# EAGLE design DAM1941_analog (EAGLE 9.3.1)

## Sheet 1 of 3
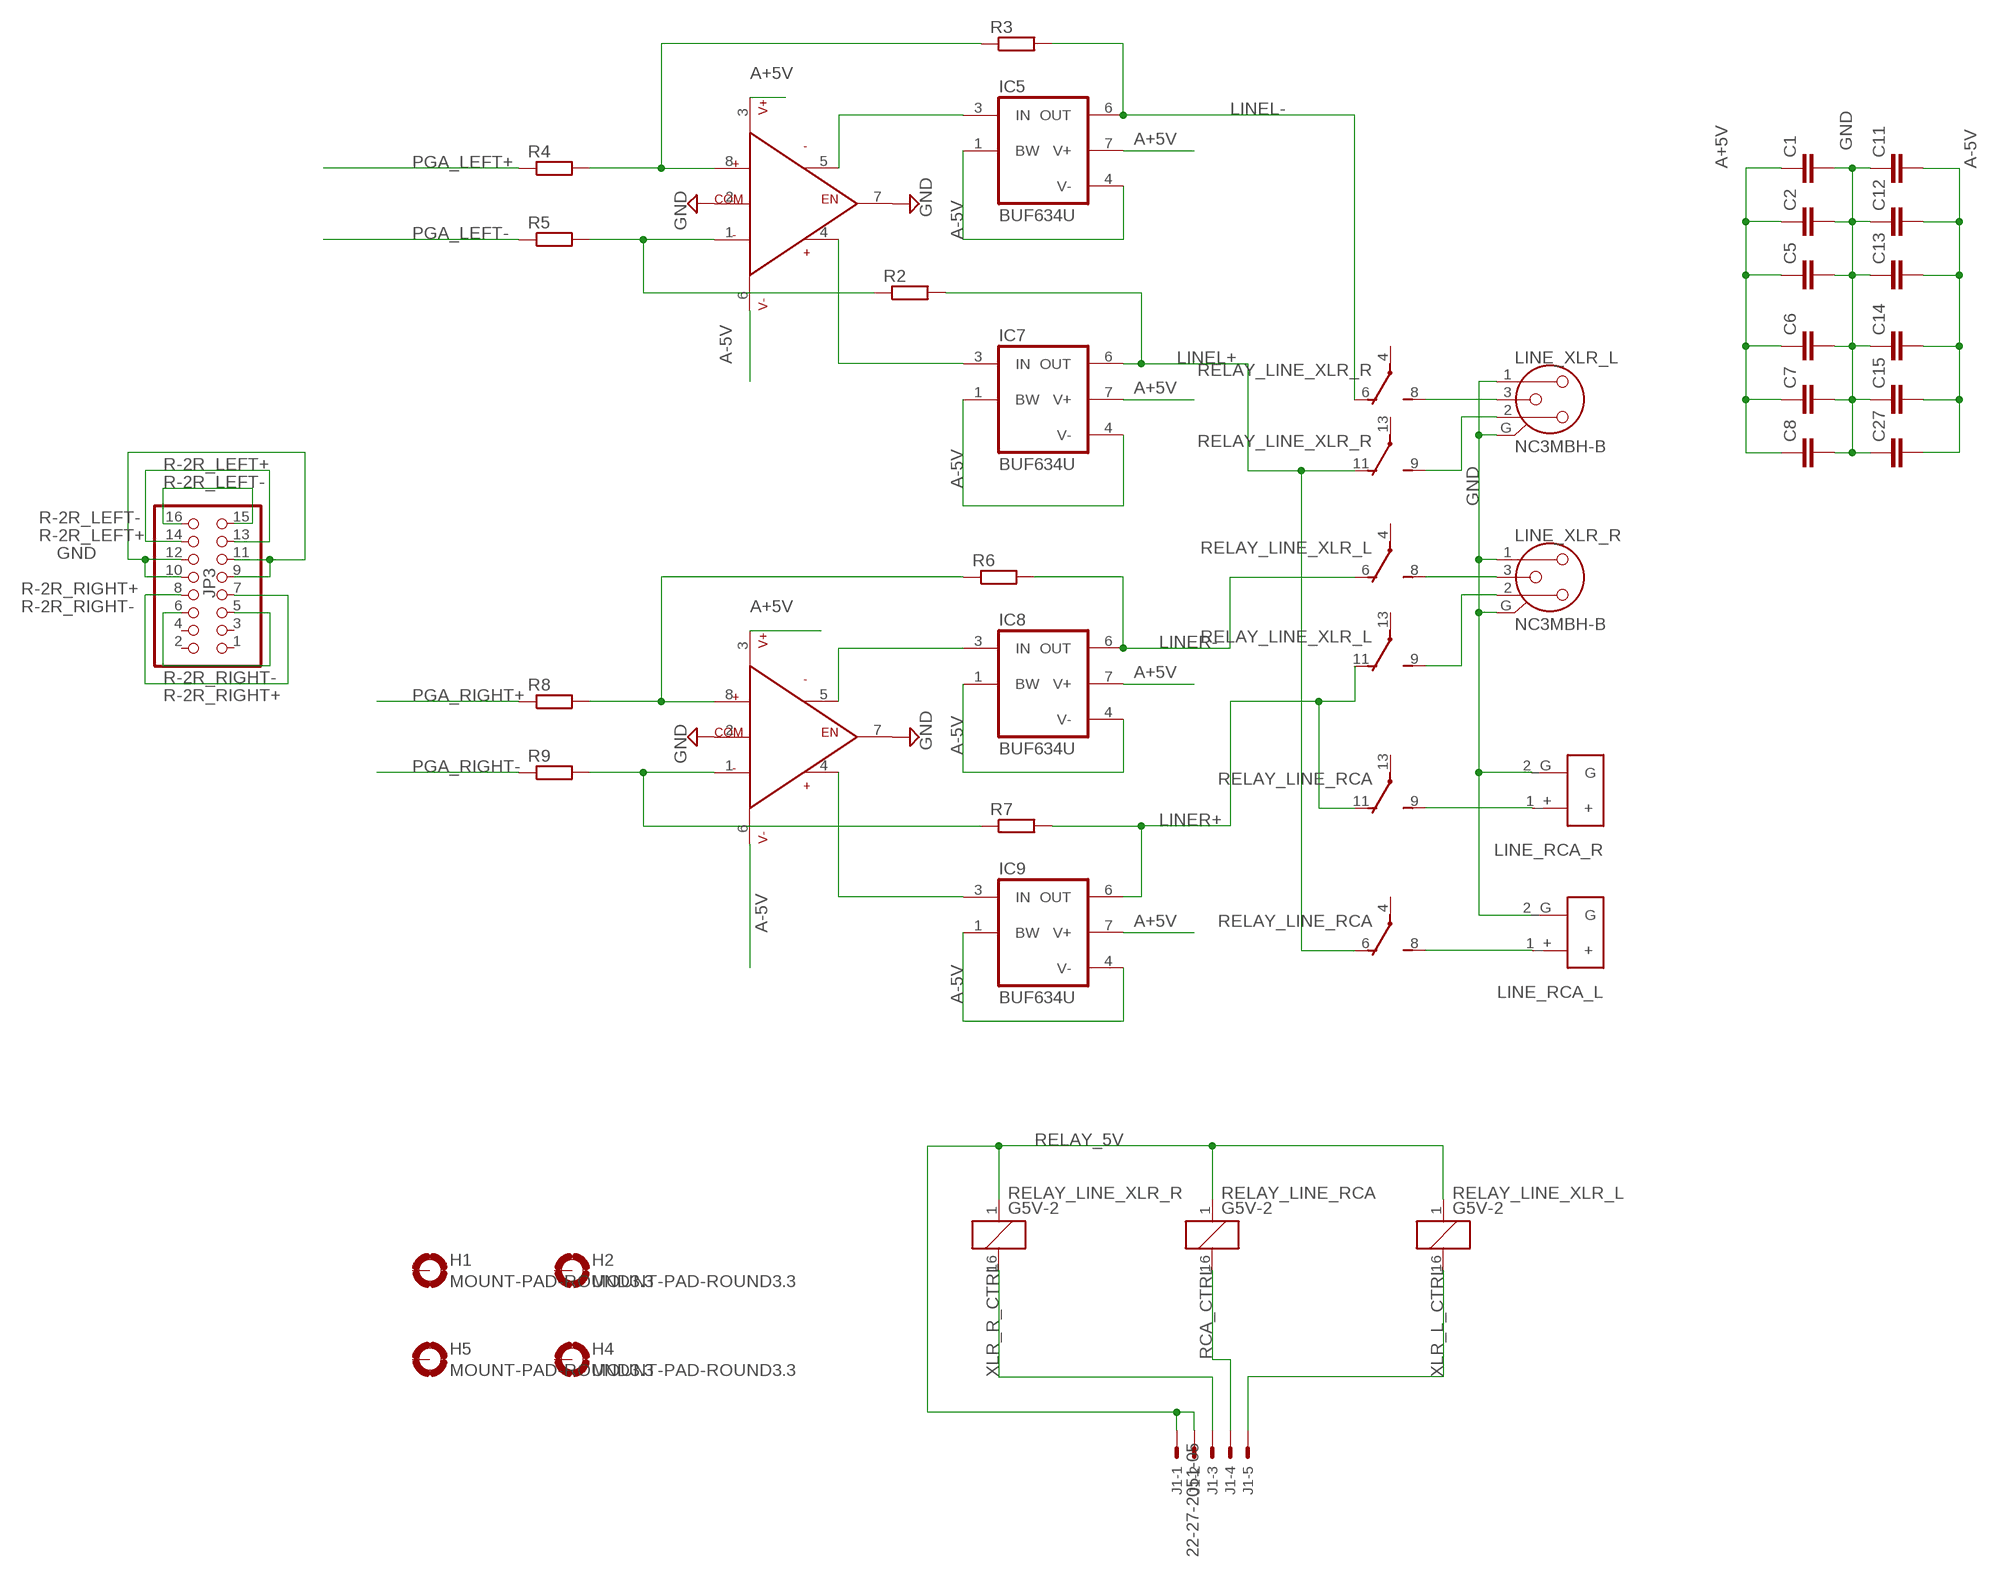
[diagram p0: schematic, sheet 1]

### Parts
C1  C-EU050-050X075  [C050-050X075]
C2  C-EU050-050X075  [C050-050X075]
C5  C-EU050-050X075  [C050-050X075]
C6  C-EU050-050X075  [C050-050X075]
C7  C-EU050-050X075  [C050-050X075]
C8  C-EU050-050X075  [C050-050X075]
C11  C-EU050-050X075  [C050-050X075]
C12  C-EU050-050X075  [C050-050X075]
C13  C-EU050-050X075  [C050-050X075]
C14  C-EU050-050X075  [C050-050X075]
C15  C-EU050-050X075  [C050-050X075]
C27  C-EU050-050X075  [C050-050X075]
H1  MOUNT-PAD-ROUND3.3  [3,3-PAD]
H2  MOUNT-PAD-ROUND3.3  [3,3-PAD]
H4  MOUNT-PAD-ROUND3.3  [3,3-PAD]
H5  MOUNT-PAD-ROUND3.3  [3,3-PAD]
IC5  BUF634U  [SO08]
IC7  BUF634U  [SO08]
IC8  BUF634U  [SO08]
IC9  BUF634U  [SO08]
J1  22-27-2051-05  [6410-05]
JP3  PINHD-2X8  [2X08]
LINE_RCA_L  RCA  [RCA]
LINE_RCA_R  RCA  [RCA]
LINE_XLR_L  NC3MBH-B  [NC3MBH-B]
LINE_XLR_R  NC3MBH-B  [NC3MBH-B]
R2  R-EU_0207/10  [0207/10]
R3  R-EU_0207/10  [0207/10]
R4  R-EU_0207/10  [0207/10]
R5  R-EU_0207/10  [0207/10]
R6  R-EU_0207/10  [0207/10]
R7  R-EU_0207/10  [0207/10]
R8  R-EU_0207/10  [0207/10]
R9  R-EU_0207/10  [0207/10]
RELAY_LINE_RCA  G5V-2  [G5V-2]
RELAY_LINE_XLR_L  G5V-2  [G5V-2]
RELAY_LINE_XLR_R  G5V-2  [G5V-2]
U$1  OPA1632  [SO8]
U$2  OPA1632  [SO8]

### Nets
A+5V: C1.1 C2.1 C5.1 C6.1 C7.1 C8.1 IC5.7(V+) IC7.7(V+) IC8.7(V+) IC9.7(V+) U$1.3(V+) U$2.3(V+) ; also sheet 2,3
A-5V: C11.2 C12.2 C13.2 C14.2 C15.2 C27.2 IC5.1(BW) IC5.4(V-) IC7.1(BW) IC7.4(V-) IC8.1(BW) IC8.4(V-) IC9.1(BW) IC9.4(V-) U$1.6(V-) U$2.6(V-) ; also sheet 2
GND: C1.2 C2.2 C5.2 C6.2 C7.2 C8.2 C11.1 C12.1 C13.1 C14.1 C15.1 C27.1 JP3.9 JP3.10 JP3.11 JP3.12 LINE_RCA_L.2_G(G) LINE_RCA_R.2_G(G) LINE_XLR_L.1 LINE_XLR_L.G LINE_XLR_R.1 LINE_XLR_R.G U$1.2(COM) U$1.7(EN) U$2.2(COM) U$2.7(EN) ; also sheet 2,3
LINEL+: IC7.6(OUT) R2.2 RELAY_LINE_RCA.6(1:O) RELAY_LINE_XLR_R.11(2:O)
LINEL-: IC5.6(OUT) R3.2 RELAY_LINE_XLR_R.6(1:O)
LINER+: IC9.6(OUT) R7.2 RELAY_LINE_RCA.11(2:O) RELAY_LINE_XLR_L.11(2:O)
LINER-: IC8.6(OUT) R6.2 RELAY_LINE_XLR_L.6(1:O)
N$6: LINE_XLR_L.3 RELAY_LINE_XLR_R.8(1:S)
N$8: LINE_XLR_L.2 RELAY_LINE_XLR_R.9(2:S)
N$9: LINE_XLR_R.3 RELAY_LINE_XLR_L.8(1:S)
N$10: LINE_XLR_R.2 RELAY_LINE_XLR_L.9(2:S)
N$11: LINE_RCA_L.1_+(+) RELAY_LINE_RCA.8(1:S)
N$12: LINE_RCA_R.1_+(+) RELAY_LINE_RCA.9(2:S)
N$13: IC5.3(IN) U$1.5(OUT-)
N$14: IC7.3(IN) U$1.4(OUT+)
N$16: R3.1 R4.2 U$1.8(IN+)
N$17: R2.1 R5.2 U$1.1(IN-)
N$20: IC9.3(IN) U$2.4(OUT+)
N$21: IC8.3(IN) U$2.5(OUT-)
N$23: R6.1 R8.2 U$2.8(IN+)
N$24: R7.1 R9.2 U$2.1(IN-)
PGA_LEFT+: R4.1 ; also sheet 2
PGA_LEFT-: R5.1 ; also sheet 2
PGA_RIGHT+: R8.1 ; also sheet 2
PGA_RIGHT-: R9.1 ; also sheet 2
R-2R_LEFT+: JP3.13 JP3.14 ; also sheet 2
R-2R_LEFT-: JP3.15 JP3.16 ; also sheet 2
R-2R_RIGHT+: JP3.7 JP3.8 ; also sheet 2
R-2R_RIGHT-: JP3.5 JP3.6 ; also sheet 2
RCA_CTRL: J1.4 RELAY_LINE_RCA.16
RELAY_5V: J1.1 J1.2 RELAY_LINE_RCA.1 RELAY_LINE_XLR_L.1 RELAY_LINE_XLR_R.1
XLR_L_CTRL: J1.5 RELAY_LINE_XLR_L.16
XLR_R_CTRL: J1.3 RELAY_LINE_XLR_R.16
Unconnected: H1.B3,3(MOUNT) H2.B3,3(MOUNT) H4.B3,3(MOUNT) H5.B3,3(MOUNT) JP3.1 JP3.2 JP3.3 JP3.4 RELAY_LINE_RCA.4(1:P) RELAY_LINE_RCA.13(2:P) RELAY_LINE_XLR_L.4(1:P) RELAY_LINE_XLR_L.13(2:P) RELAY_LINE_XLR_R.4(1:P) RELAY_LINE_XLR_R.13(2:P)

## Sheet 2 of 3
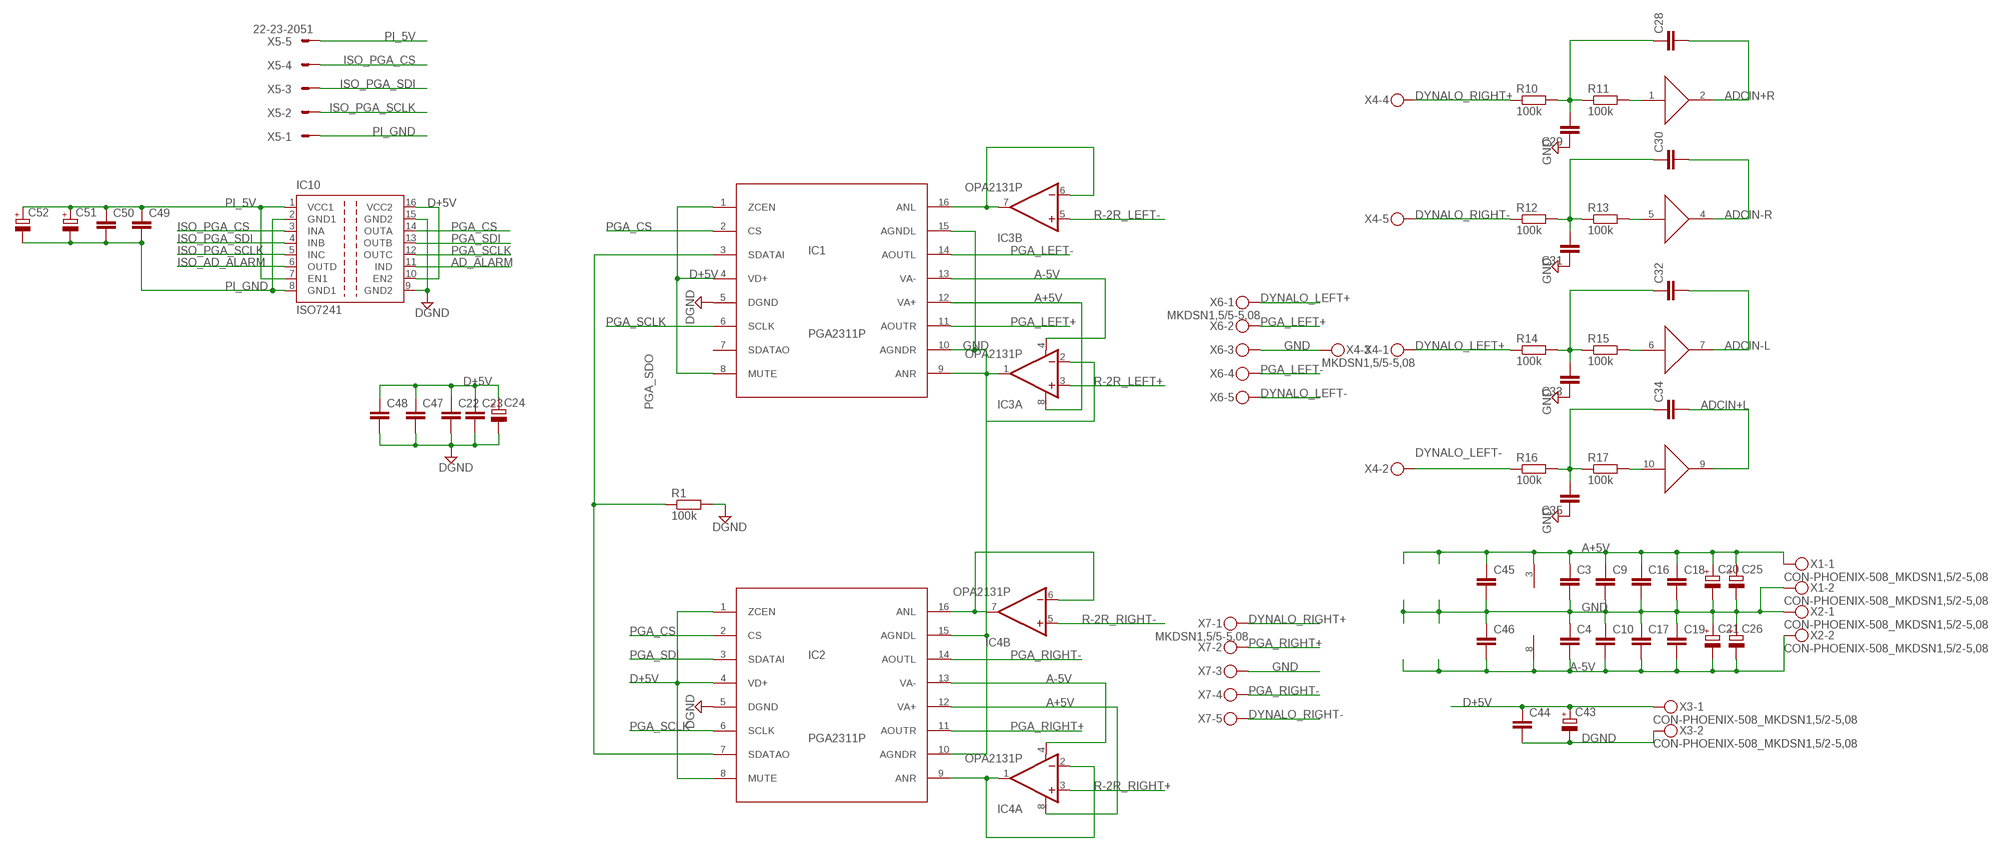
[diagram p1: schematic, sheet 2]

### Parts
C3  C-EU050-050X075  [C050-050X075]
C4  C-EU050-050X075  [C050-050X075]
C9  C-EU050-050X075  [C050-050X075]
C10  C-EU050-050X075  [C050-050X075]
C16  C-EU050-050X075  [C050-050X075]
C17  C-EU050-050X075  [C050-050X075]
C18  C-EU050-050X075  [C050-050X075]
C19  C-EU050-050X075  [C050-050X075]
C20  CPOL-EUE5-10.5  [E5-10,5]
C21  CPOL-EUE5-10.5  [E5-10,5]
C22  C-EU050-050X075  [C050-050X075]
C23  C-EU050-050X075  [C050-050X075]
C24  CPOL-EUE5-10.5  [E5-10,5]
C25  CPOL-EUE5-13  [E5-13]
C26  CPOL-EUE5-13  [E5-13]
C28  C-EUC1206  [C1206]
C29  C-EUC1206  [C1206]
C30  C-EUC1206  [C1206]
C31  C-EUC1206  [C1206]
C32  C-EUC1206  [C1206]
C33  C-EUC1206  [C1206]
C34  C-EUC1206  [C1206]
C35  C-EUC1206  [C1206]
C43  CPOL-EUE5-10.5  [E5-10,5]
C44  C-EU050-050X075  [C050-050X075]
C45  C-EUC0603K  [C0603K]
C46  C-EUC0603K  [C0603K]
C47  C-EUC0603K  [C0603K]
C48  C-EUC0603K  [C0603K]
C49  C-EUC0603K  [C0603K]
C50  C-EUC0603K  [C0603K]
C51  CPOL-EUE5-8.5  [E5-8,5]
C52  CPOL-EUE5-8.5  [E5-8,5]
IC1  PGA2311P  [DIL16]
IC2  PGA2311P  [DIL16]
IC3  OPA2131P  [DIL08]
IC4  OPA2131P  [DIL08]
IC10  ISO7241  [SO-16DW]
R1  100k  R-EU_MELF0204R  [MINI_MELF-0204R]
R10  100k  R-EU_MELF0204R  [MINI_MELF-0204R]
R11  100k  R-EU_MELF0204R  [MINI_MELF-0204R]
R12  100k  R-EU_MELF0204R  [MINI_MELF-0204R]
R13  100k  R-EU_MELF0204R  [MINI_MELF-0204R]
R14  100k  R-EU_MELF0204R  [MINI_MELF-0204R]
R15  100k  R-EU_MELF0204R  [MINI_MELF-0204R]
R16  100k  R-EU_MELF0204R  [MINI_MELF-0204R]
R17  100k  R-EU_MELF0204R  [MINI_MELF-0204R]
U$3  AD8244  [MSOP10]
X1  CON-PHOENIX-508_MKDSN1,5/2-5,08  [CON-PHOENIX-508_MKDSN1,5/2-5,08]
X2  CON-PHOENIX-508_MKDSN1,5/2-5,08  [CON-PHOENIX-508_MKDSN1,5/2-5,08]
X3  CON-PHOENIX-508_MKDSN1,5/2-5,08  [CON-PHOENIX-508_MKDSN1,5/2-5,08]
X4  MKDSN1,5/5-5,08  [MKDSN1,5/5-5,08]
X5  22-23-2051  [22-23-2051]
X6  MKDSN1,5/5-5,08  [MKDSN1,5/5-5,08]
X7  MKDSN1,5/5-5,08  [MKDSN1,5/5-5,08]

### Nets
A+5V: C3.1 C9.1 C16.1 C18.1 C20.+ C25.+ C45.1 IC1.12(VA+) IC2.12(VA+) IC3.8(A:V+) IC4.8(A:V+) U$3.3(V+) X1.1 ; also sheet 1,3
A-5V: C4.2 C10.2 C17.2 C19.2 C21.- C26.- C46.2 IC1.13(VA-) IC2.13(VA-) IC3.4(A:V-) IC4.4(A:V-) U$3.8(V-) X2.2 ; also sheet 1
AD_ALARM: IC10.11(IND) ; also sheet 3
ADCIN+L: C34.2 U$3.9(OUT) ; also sheet 3
ADCIN+R: C28.2 U$3.2(OUT) ; also sheet 3
ADCIN-L: C32.2 U$3.7(OUT) ; also sheet 3
ADCIN-R: C30.2 U$3.4(OUT) ; also sheet 3
D+5V: C22.1 C23.1 C24.+ C43.+ C44.1 C47.1 C48.1 IC1.1(ZCEN) IC1.4(VD+) IC1.8(MUTE) IC2.1(ZCEN) IC2.4(VD+) IC2.8(MUTE) IC10.10(EN2) IC10.16(VCC2) X3.1 ; also sheet 3
DGND: C22.2 C23.2 C24.- C43.- C44.2 C47.2 C48.2 IC1.5(DGND) IC2.5(DGND) IC10.9(GND2) IC10.15(GND2) R1.2 X3.2 ; also sheet 3
DYNALO_LEFT+: R14.1 X4.1 X6.1
DYNALO_LEFT-: R16.1 X4.2 X6.5
DYNALO_RIGHT+: R10.1 X4.4 X7.1
DYNALO_RIGHT-: R12.1 X4.5 X7.5
GND: C3.2 C4.1 C9.2 C10.1 C16.2 C17.1 C18.2 C19.1 C20.- C21.+ C25.- C26.+ C29.1 C31.1 C33.1 C35.1 C45.2 C46.1 IC1.10(AGNDR) IC1.15(AGNDL) IC2.10(AGNDR) IC2.15(AGNDL) X1.2 X2.1 X4.3 X6.3 X7.3 ; also sheet 1,3
ISO_AD_ALARM: IC10.6(OUTD) ; also sheet 3
ISO_PGA_CS: IC10.3(INA) X5.4
ISO_PGA_SCLK: IC10.5(INC) X5.2
ISO_PGA_SDI: IC10.4(INB) X5.3
N$2: IC2.9(ANR) IC4.1(A:OUT) IC4.2(A:-IN)
N$3: IC2.16(ANL) IC4.6(B:-IN) IC4.7(B:OUT)
N$4: IC1.9(ANR) IC3.1(A:OUT) IC3.2(A:-IN)
N$5: IC1.16(ANL) IC3.6(B:-IN) IC3.7(B:OUT)
N$25: C28.1 C29.2 R10.2 R11.1
N$26: R11.2 U$3.1(IN)
N$27: C30.1 C31.2 R12.2 R13.1
N$29: R13.2 U$3.5(IN)
N$31: C32.1 C33.2 R14.2 R15.1
N$32: R15.2 U$3.6(IN)
N$34: C34.1 C35.2 R16.2 R17.1
N$35: R17.2 U$3.10(IN)
PGA_CS: IC1.2(CS) IC2.2(CS) IC10.14(OUTA)
PGA_LEFT+: IC1.11(AOUTR) X6.2 ; also sheet 1
PGA_LEFT-: IC1.14(AOUTL) X6.4 ; also sheet 1
PGA_RIGHT+: IC2.11(AOUTR) X7.2 ; also sheet 1
PGA_RIGHT-: IC2.14(AOUTL) X7.4 ; also sheet 1
PGA_SCLK: IC1.6(SCLK) IC2.6(SCLK) IC10.12(OUTC)
PGA_SDI: IC2.3(SDATAI) IC10.13(OUTB)
PGA_SDO: IC1.3(SDATAI) IC2.7(SDATAO) R1.1
PI_5V: C49.1 C50.1 C51.+ C52.+ IC10.1(VCC1) IC10.7(EN1) X5.5 ; also sheet 3
PI_GND: C49.2 C50.2 C51.- C52.- IC10.2(GND1) IC10.8(GND1) X5.1 ; also sheet 3
R-2R_LEFT+: IC3.3(A:+IN) ; also sheet 1
R-2R_LEFT-: IC3.5(B:+IN) ; also sheet 1
R-2R_RIGHT+: IC4.3(A:+IN) ; also sheet 1
R-2R_RIGHT-: IC4.5(B:+IN) ; also sheet 1
Unconnected: IC1.7(SDATAO)

## Sheet 3 of 3
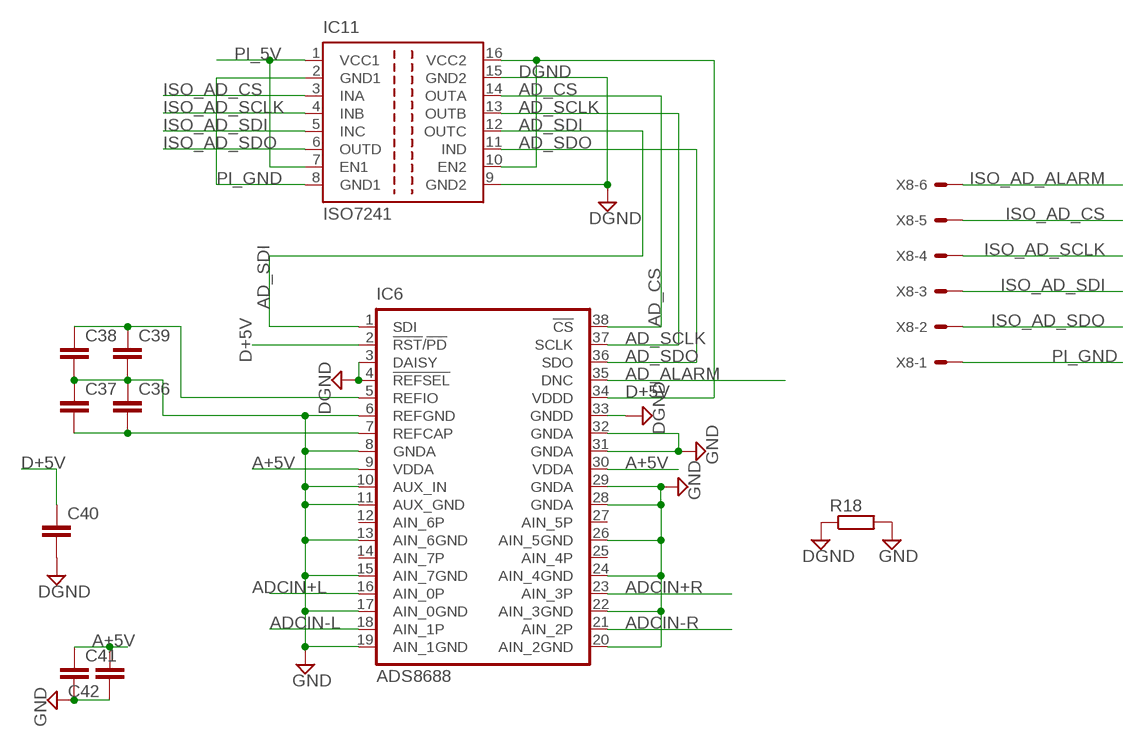
[diagram p2: schematic, sheet 3]

### Parts
C36  C-EUC0603K  [C0603K]
C37  C-EU050-035X075  [C050-035X075]
C38  C-EU050-035X075  [C050-035X075]
C39  C-EUC0603K  [C0603K]
C40  C-EUC0603K  [C0603K]
C41  C-EUC0603K  [C0603K]
C42  C-EUC0603K  [C0603K]
IC6  ADS8688  [DBT_R-PDSO-G38]
IC11  ISO7241  [SO-16DW]
R18  R-EU_MELF0204R  [MINI_MELF-0204R]
X8  22-23-2061  [22-23-2061]

### Nets
A+5V: C41.1 C42.2 IC6.9(VDDA) IC6.30(VDDA) ; also sheet 1,2
AD_ALARM: IC6.35(DNC) ; also sheet 2
AD_CS: IC6.38(!CS) IC11.14(OUTA)
AD_SCLK: IC6.37(SCLK) IC11.13(OUTB)
AD_SDI: IC6.1(SDI) IC11.12(OUTC)
AD_SDO: IC6.36(SDO) IC11.11(IND)
ADCIN+L: IC6.16(AIN_0P) ; also sheet 2
ADCIN+R: IC6.23(AIN_3P) ; also sheet 2
ADCIN-L: IC6.18(AIN_1P) ; also sheet 2
ADCIN-R: IC6.21(AIN_2P) ; also sheet 2
D+5V: C40.1 IC6.2(!RST!/!PD) IC6.34(VDDD) IC11.10(EN2) IC11.16(VCC2) ; also sheet 2
DGND: C40.2 IC6.3(DAISY) IC6.4(!REFSEL) IC6.33(GNDD) IC11.9(GND2) IC11.15(GND2) R18.1 ; also sheet 2
GND: C36.1 C37.1 C38.2 C39.2 C41.2 C42.1 IC6.6(REFGND) IC6.8(GNDA) IC6.10(AUX_IN) IC6.11(AUX_GND) IC6.13(AIN_6GND) IC6.15(AIN_7GND) IC6.17(AIN_0GND) IC6.19(AIN_1GND) IC6.20(AIN_2GND) IC6.22(AIN_3GND) IC6.24(AIN_4GND) IC6.26(AIN_5GND) IC6.28(GNDA) IC6.29(GNDA) IC6.31(GNDA) IC6.32(GNDA) R18.2 ; also sheet 1,2
ISO_AD_ALARM: X8.6 ; also sheet 2
ISO_AD_CS: IC11.3(INA) X8.5
ISO_AD_SCLK: IC11.4(INB) X8.4
ISO_AD_SDI: IC11.5(INC) X8.3
ISO_AD_SDO: IC11.6(OUTD) X8.2
N$30: C36.2 C37.2 IC6.7(REFCAP)
N$33: C38.1 C39.1 IC6.5(REFIO)
PI_5V: IC11.1(VCC1) IC11.7(EN1) ; also sheet 2
PI_GND: IC11.2(GND1) IC11.8(GND1) X8.1 ; also sheet 2
Unconnected: IC6.12(AIN_6P) IC6.14(AIN_7P) IC6.25(AIN_4P) IC6.27(AIN_5P)

## Library data of the parts
C1-C19 C22 C23 C27-C42 C44-C50 = Vwvwbg:C-EU: CAPACITOR, European symbol
C20 C21 C24-C26 C43 C51 C52 = Vwvwbg:CPOL-EU: POLARIZED CAPACITOR, European symbol
H1 H2 H4 H5 = holes:MOUNT-PAD-ROUND: MOUNTING PAD, round
IC1 IC2 = Vwvwbg:PGA2311
IC3 IC4 = burr-brown:OPA2131: General Purpose FET-Input Operational Amplifiers Product Folder:OPA2131; OC_FARNELL: unknown; OC_NEWARK: unknown
IC5 IC7-IC9 = burr-brown:BUF634: 250mA High-Speed Buffer; MF: TEXAS INSTRUMENTS; MPN: BUF634U; OC_FARNELL: 4733617; OC_NEWARK: 27C6567
IC6 = texas:ADS8688: ADS868x 16-Bit, 500-kSPS, 8-Channel, Single-Supply, SAR ADCs with Bipolar Input Ranges Source: Data sheet <http://www.ti.com/lit/ds/symlink/ads8688.pdf>
IC10 IC11 = texas:ISO7241: HIGH SPEED QUAD DIGITAL ISOLATORS Source: http://focus.ti.com/lit/ds/symlink/iso7240m.pdf; MPN: ISO7241CDW; OC_FARNELL: 1575372; OC_NEWARK: 73M3155
J1 = con-molex:22-?-05: CONNECTOR wire to board 2.54 mm (.1 inch) pitch header; MF: MOLEX; OC_FARNELL: unknown; OC_NEWARK: unknown
JP3 = pinhead:PINHD-2X8: PIN HEADER
LINE_RCA_L LINE_RCA_R = Vwvwbg:RCA
LINE_XLR_L LINE_XLR_R = con-neutrik_ag:NC3: Neutrik Audio Connector XLR SERIES Stereo 1/4" jack Source: www.neutrik.com/; MPN: NC3MBH-B; OC_FARNELL: unknown; OC_NEWARK: 27B4288
R1-R18 = Vwvwbg:R-EU_: RESISTOR, European symbol
RELAY_LINE_RCA RELAY_LINE_XLR_L RELAY_LINE_XLR_R = relay:G5V-2: OMRON PCB Relay Source: http://www.omron.com/ecb/products/pdf/en-g5v2.pdf; MPN: G5V-2 5DC; OC_FARNELL: 9949488; OC_NEWARK: 78K5703
U$1 U$2 = Vwvwbg:OPA1632
U$3 = Vwvwbg:AD8244
X1-X3 = Vwvwbg:CON-PHOENIX-508_MKDSN1,5/2-5,08: MKDSN 1,5/ 2-5,08 Printklemme Nennstrom: 13,5 A Nennspannung: 250 V Rastermaß: 5,08 mm Polzahl: 2 Anschlussart: Schraubanschluss Montage: Löten Anschlussrichtung Leiter/Platine: 0 ° Artikelnummer: 1729128 Source: http://eshop.phoenixcontact.com .. 1729128.pdf
X4 X6 X7 = Vwvwbg:MKDSN1,5/5-5,08: MKDSN 1,5/ 5-5,08 Printklemme Nennstrom: 13,5 A Nennspannung: 250 V Rastermaß: 5,08 mm Polzahl: 5 Anschlussart: Schraubanschluss Montage: Löten Anschlussrichtung Leiter/Platine: 0 ° Artikelnummer: 1729157 Source: http://eshop.phoenixcontact.com .. 1729157.pdf
X5 = con-molex:22-23-2051: .100" (2.54mm) Center Header - 5 Pin; MF: MOLEX; MPN: 22-23-2051; OC_FARNELL: 1462952; OC_NEWARK: 38C9178
X8 = con-molex:22-23-2061: .100" (2.54mm) Center Header - 6 Pin; MF: MOLEX; MPN: 22-23-2061; OC_FARNELL: 1462922; OC_NEWARK: 27C1933

## Board
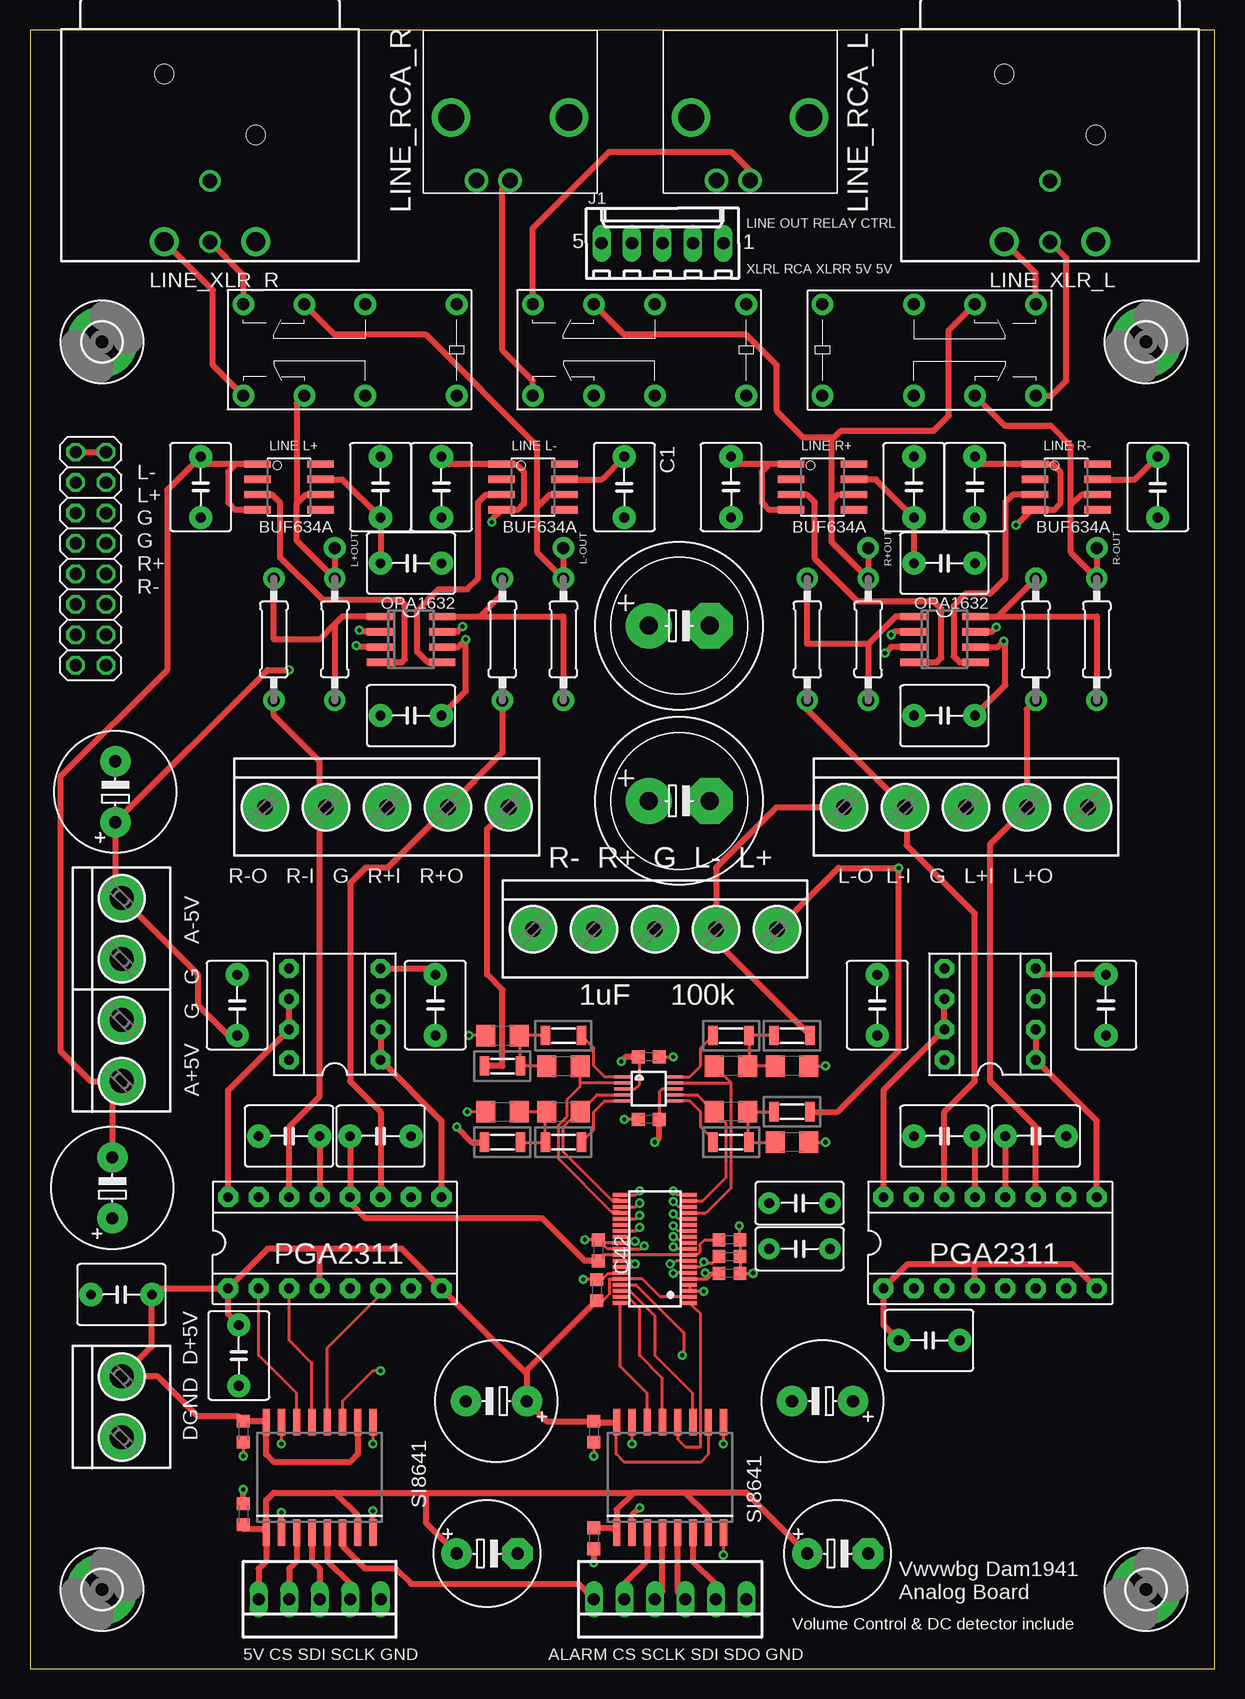
[diagram p3: board, top side]
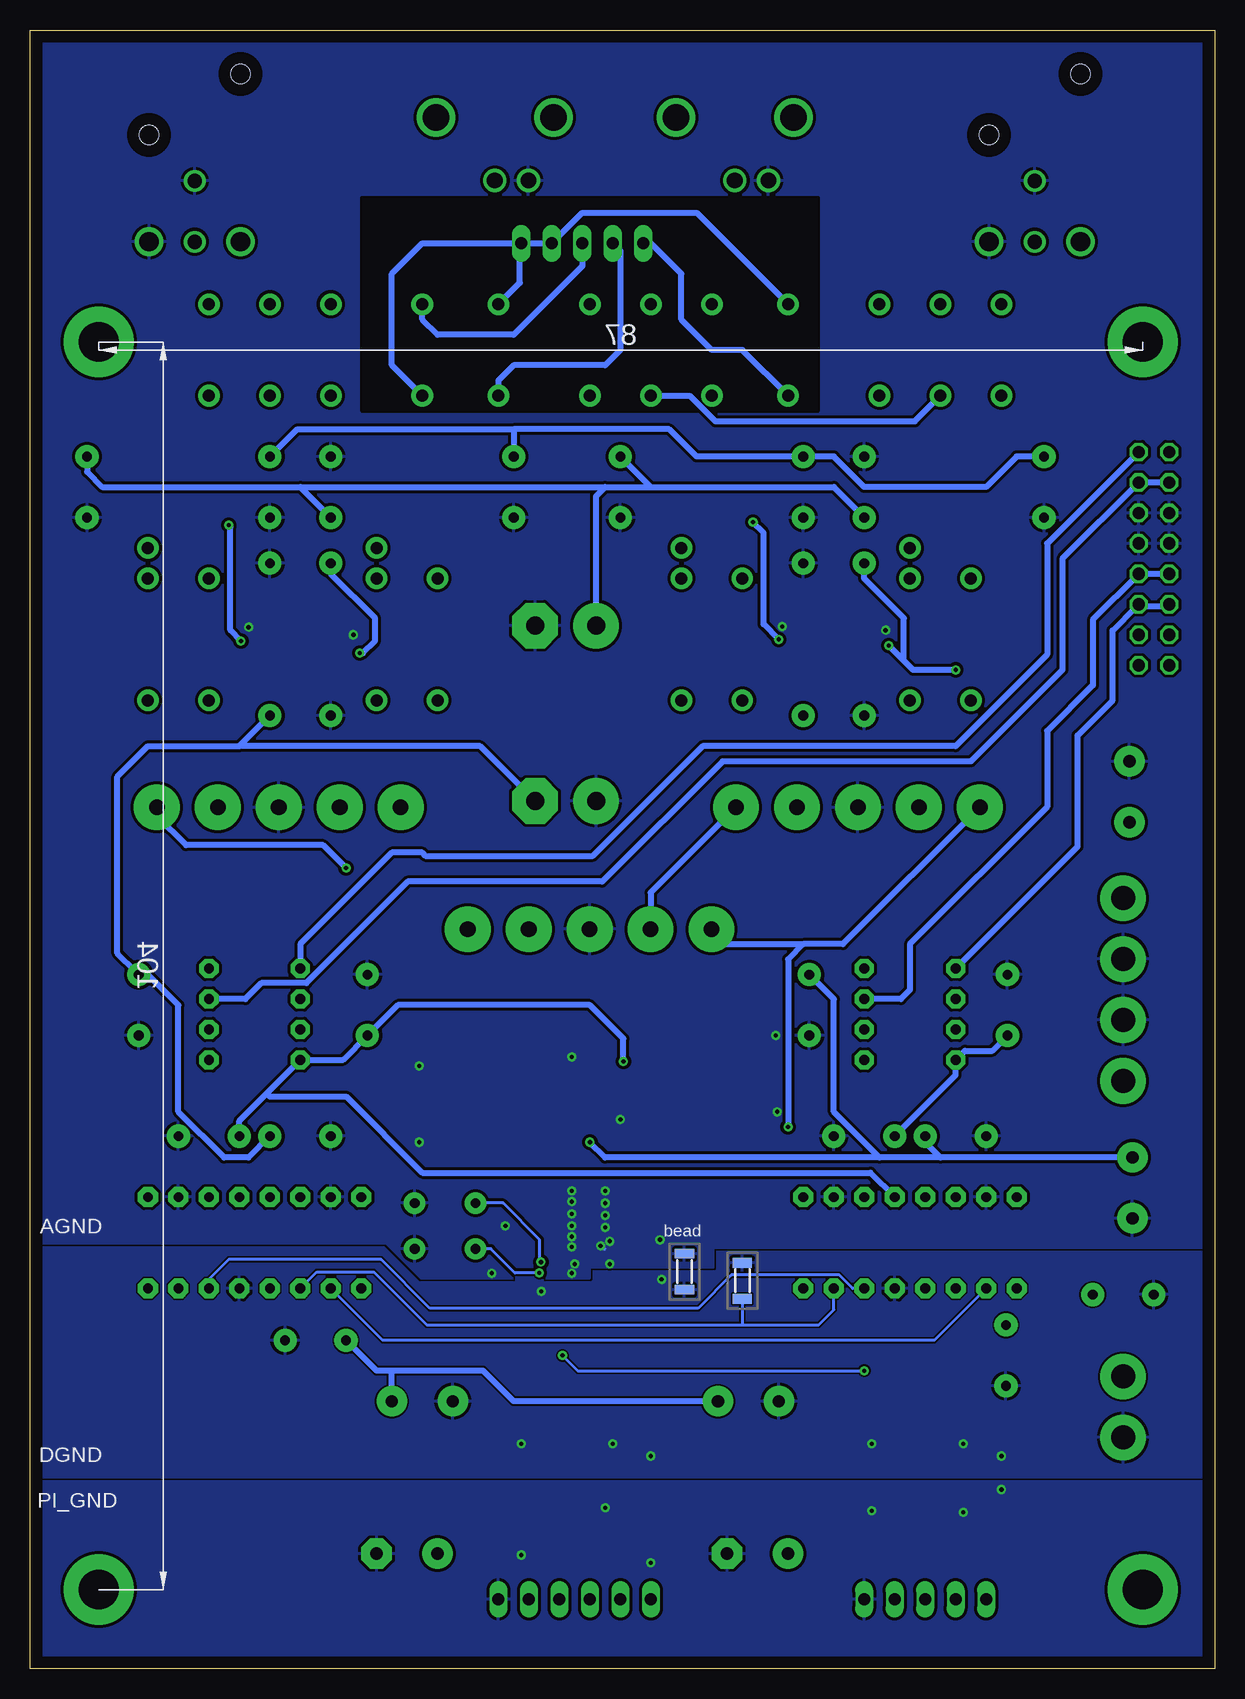
[diagram p4: board, bottom side, seen from below]

Size 98.73 x 136.6 mm. Coordinates in mm from the lower left corner, seen from the top.
Outline: 0,0 98.73,0 98.73,136.6 0,136.6 0,0
Copper layers (1*16): Top 0.035mm / dielectric 1.5mm / Bottom 0.035mm
Design rules "default *": minimum track width 6mil, minimum drill 0.35mm, track to track 6mil, track to pad 6mil, pad to pad 6mil, via to via 6mil, smd to smd 6mil, copper to edge 40mil, drill to drill 6mil, minimum pad ring 10mil, minimum via ring 8mil, stop-mask expansion 4mil, vias tented up to drill 0.36mm, thermal gap 10mil

### Footprints (pad centres in the part's own frame; a part is rotated, then mirrored left to right if it is on the bottom)
C050-050X075 = drill 0.813 pad 1.93: 1 -2.54,0; 2 2.54,0
E5-10,5 = drill 1.016 pad 2.54: + -2.54,0; - 2.54,0
E5-13 = drill 1.5 pad 3.81: + -2.54,0 | drill 1.5 pad 3.81 octagon: - 2.54,0
C1206 = smd 1.6 x 1.8: 1 -1.4,0; 2 1.4,0
C0603K = smd 1.05 x 1.08: 1 -0.875,0; 2 0.875,0
C050-035X075 = drill 0.813 pad 1.778: 1 -2.54,0; 2 2.54,0
E5-8,5 = drill 1.016 pad 2.54: + -2.54,0 | drill 1.016 pad 2.54 octagon: - 2.54,0
3,3-PAD = drill 3.3 pad 5.842: B3,3 0,0
DIL16 = drill 0.813 pad 1.676 octagon: 1 -8.89,-3.81; 2 -6.35,-3.81; 3 -3.81,-3.81; 4 -1.27,-3.81; 5 1.27,-3.81; 6 3.81,-3.81; 7 6.35,-3.81; 8 8.89,-3.81; 9 8.89,3.81; 10 6.35,3.81; 11 3.81,3.81; 12 1.27,3.81; 13 -1.27,3.81; 14 -3.81,3.81; 15 -6.35,3.81; 16 -8.89,3.81
DIL08 = drill 0.813 pad 1.6 octagon: 1 -3.81,-3.81; 2 -1.27,-3.81; 3 1.27,-3.81; 4 3.81,-3.81; 5 3.81,3.81; 6 1.27,3.81; 7 -1.27,3.81; 8 -3.81,3.81
SO08 = smd 0.61 x 2.21: 1 -1.905,-2.616; 2 -0.635,-2.616; 3 0.635,-2.616; 4 1.905,-2.616; 5 1.905,2.616; 6 0.635,2.616; 7 -0.635,2.616; 8 -1.905,2.616
DBT_R-PDSO-G38 = smd 0.3 x 1.2: 1 -4.5,-2.9; 2 -4,-2.9; 3 -3.5,-2.9; 4 -3,-2.9; 5 -2.5,-2.9; 6 -2,-2.9; 7 -1.5,-2.9; 8 -1,-2.9; 9 -0.5,-2.9; 10 0,-2.9; 11 0.5,-2.9; 12 1,-2.9; 13 1.5,-2.9; 14 2,-2.9; 15 2.5,-2.9; 16 3,-2.9; 17 3.5,-2.9; 18 4,-2.9; 19 4.5,-2.9; 20 4.5,2.9; 21 4,2.9; 22 3.5,2.9; 23 3,2.9; 24 2.5,2.9; 25 2,2.9; 26 1.5,2.9; 27 1,2.9; 28 0.5,2.9; 29 0,2.9; 30 -0.5,2.9; 31 -1,2.9; 32 -1.5,2.9; 33 -2,2.9; 34 -2.5,2.9; 35 -3,2.9; 36 -3.5,2.9; 37 -4,2.9; 38 -4.5,2.9
SO-16DW = smd 0.6 x 2.2: 1 -4.445,-4.6; 2 -3.175,-4.6; 3 -1.905,-4.6; 4 -0.635,-4.6; 5 0.635,-4.6; 6 1.905,-4.6; 7 3.175,-4.6; 8 4.445,-4.6; 9 4.445,4.6; 10 3.175,4.6; 11 1.905,4.6; 12 0.635,4.6; 13 -0.635,4.6; 14 -1.905,4.6; 15 -3.175,4.6; 16 -4.445,4.6
6410-05 = drill 1.016 long: 1 5.08,0; 2 2.54,0; 3 0,0; 4 -2.54,0; 5 -5.08,0
2X08 = drill 1.016 octagon: 1 -8.89,-1.27; 2 -8.89,1.27; 3 -6.35,-1.27; 4 -6.35,1.27; 5 -3.81,-1.27; 6 -3.81,1.27; 7 -1.27,-1.27; 8 -1.27,1.27; 9 1.27,-1.27; 10 1.27,1.27; 11 3.81,-1.27; 12 3.81,1.27; 13 6.35,-1.27; 14 6.35,1.27; 15 8.89,-1.27; 16 8.89,1.27
RCA = drill 1.3: 1_+ 0,0; 2_G -2.8,0 | drill 2.2: 3_NC -4.9,5.25; 4_NC 4.9,5.25
NC3MBH-B = drill 1.6: 1 3.81,0; 2 -3.81,0 | drill 1.2: 3 0,0; G 0,5.08 | hole 1.6: -3.81,13.97; 3.81,8.89
MINI_MELF-0204R = smd 0.8 x 1.6: 1 -1.5,0; 2 1.5,0
0207/10 = drill 1 pad 1.778: 1 -5.08,0; 2 5.08,0
G5V-2 = drill 1 pad 1.8: 1 -8.89,-3.81; 4 -1.27,-3.81; 6 3.81,-3.81; 8 8.89,-3.81; 9 8.89,3.81; 11 3.81,3.81; 13 -1.27,3.81; 16 -8.89,3.81
SO8 = smd 0.6 x 2.2: 1 -1.905,-2.6; 2 -0.635,-2.6; 3 0.635,-2.6; 4 1.905,-2.6; 5 1.905,2.6; 6 0.635,2.6; 7 -0.635,2.6; 8 -1.905,2.6
MSOP10 = smd 0.25 x 1.5: 1 -1,-2.113; 2 -0.5,-2.113; 3 0,-2.113; 4 0.5,-2.113; 5 1,-2.113; 6 1,2.113; 7 0.5,2.113; 8 0,2.113; 9 -0.5,2.113; 10 -1,2.113
CON-PHOENIX-508_MKDSN1,5/2-5,08 = drill 2 pad 3.81: 1 -2.561,0.025; 2 2.519,0.025
MKDSN1,5/5-5,08 = drill 1.3 pad 3.81: 1 -10.181,0.025; 2 -5.101,0.025; 3 -0.021,0.025; 4 5.059,0.025; 5 10.139,0.025
22-23-2051 = drill 1 long: 1 -5.08,0; 2 -2.54,0; 3 0,0; 4 2.54,0; 5 5.08,0
22-23-2061 = drill 1 long: 1 -6.35,0; 2 -3.81,0; 3 -1.27,0; 4 1.27,0; 5 3.81,0; 6 6.35,0

### Placement (x,y rotation side)
C1  49.53,98.5 270 top
C2  29.21,98.5 90 top
C3  83.82,44.4 0 top
C4  76.2,44.4 0 top
C5  73.66,98.5 90 top
C6  93.98,98.5 270 top
C7  76.2,92.15 0 top
C8  31.75,92.15 0 top
C9  29.21,44.4 0 top
C10  21.59,44.4 0 top
C11  34.29,98.5 90 top
C12  58.42,98.5 90 top
C13  78.74,98.5 90 top
C14  14.22,98.5 90 top
C15  31.75,79.45 0 top
C16  70.61,55.32 90 top
C17  89.66,55.32 90 top
C18  17.27,55.32 90 top
C19  33.78,55.32 90 top
C20  7.11,73.1 90 top
C21  6.86,40.08 90 top
C22  74.93,27.38 0 top
C23  17.4,26.11 270 top
C24  38.86,22.3 180 top
C25  54.1,86.94 0 top
C26  54.1,72.34 0 top
C27  76.2,79.45 0 top
C28  44.45,50.24 0 top
C29  39.37,52.78 0 top
C30  44.45,46.43 0 top
C31  39.37,46.43 0 top
C32  58.42,46.43 180 top
C33  63.5,43.89 180 top
C34  58.42,50.24 180 top
C35  63.5,50.24 180 top
C36  58.29,34.36 180 top
C37  64.14,38.81 180 top
C38  64.14,35 0 top
C39  58.29,32.97 0 top
C40  47.24,31.57 90 top
C41  58.29,35.76 0 top
C42  47.37,34.87 270 top
C43  66.04,22.3 180 top
C44  7.62,31.19 180 top
C45  51.56,51 0 top
C46  51.56,45.79 0 top
C47  17.78,19.76 270 top
C48  46.99,19.76 270 top
C49  46.99,10.87 270 top
C50  17.78,12.9 90 top
C51  67.31,9.6 0 top
C52  38.1,9.6 0 top
H1  6,6.6 0 top
H2  93,6.6 0 top
H4  6,110.6 0 top
H5  93,110.6 0 top
IC1  80.01,35.51 0 top
IC2  25.4,35.51 0 top
IC3  80.01,54.56 90 top
IC4  25.4,54.56 90 top
IC5  86.36,98.5 270 top
IC6  52.07,35 90 top
IC7  66.04,98.5 270 top
IC8  41.91,98.5 270 top
IC9  21.59,98.5 270 top
IC10  24.13,15.95 0 top
IC11  53.34,15.95 0 top
J1  52.7,118.82 0 top
JP3  5.07,92.53 90 top
LINE_RCA_L  60,124.05 0 top
LINE_RCA_R  40,124.05 0 top
LINE_XLR_L  85,118.95 0 top
LINE_XLR_R  15,118.95 0 top
R1  39.37,32.33 90 bottom
R2  69.85,85.8 90 top
R3  88.9,85.8 90 top
R4  83.82,85.8 90 top
R5  64.77,85.8 90 top
R6  44.45,85.8 90 top
R7  25.4,85.8 90 top
R8  39.37,85.8 90 top
R9  20.32,85.8 90 top
R10  39.37,50.24 0 top
R11  44.45,52.78 0 top
R12  39.37,43.89 0 top
R13  44.45,43.89 0 top
R14  63.5,46.43 180 top
R15  58.42,43.89 180 top
R16  63.5,52.78 180 top
R17  58.42,52.78 180 top
R18  44.2,33.09 90 bottom
RELAY_LINE_RCA  50.8,109.93 180 top
RELAY_LINE_XLR_L  26.67,109.93 180 top
RELAY_LINE_XLR_R  74.93,109.93 0 top
U$1  76.2,85.8 270 top
U$2  31.75,85.8 270 top
U$3  51.56,48.33 270 top
X1  7.62,61.67 270 top
X2  7.62,51.51 270 top
X3  7.62,21.79 270 top
X4  52.07,61.67 180 top
X5  24.13,5.79 180 top
X6  77.98,71.83 180 top
X7  29.72,71.83 180 top
X8  53.34,5.79 180 top

### Tracks (layer width: path | path; a pad name or v marks a point on that pad's centre or on a via)
A+5V  (via drill 0.35)
  Top 0.254: C42.2 47.87,34.5 IC6.30 IC6.9 55.04,34.57 55.69,34.57 55.85,34.73 55.85,35.38 56.23,35.76 C41.1 | U$3.3 50.42,48.33 50.8,48.72 50.8,50.89 C45.1
  Top 0.508: C9.1 IC2.12 26.67,38.81 27.94,37.54 42.67,37.54 46.21,34 C42.2 | IC9.7 26.04,99.13 C2.1 C8.1 | C7.1 C5.1 70.48,99.13 IC7.7 | IC8.7 47.62,99.13 C1.1 | IC5.7 92.08,99.13 C6.1 | U$2.3 27.3,85.16 v27.18,85.29 | U$1.3 71.75,85.16 v71.25,84.66 | v21.59,83.26 19.81,83.26 C20.+ 7.11,64.76 X1.1 13.97,57.91 13.97,55.32 16.51,52.78 C18.1 | C45.1 49.66,51 v49.28,50.62 | C3.1 IC1.12
  Bottom 0.508: C18.1 18.54,51.51 20.83,51.51 IC4.8 21.59,49.48 C9.1 | C6.1 93.98,99.77 92.71,98.5 76.2,98.5 | 76.2,98.5 C5.1 | 76.2,98.5 50.8,98.5 | 50.8,98.5 46.99,98.5 | 46.99,98.5 31.75,98.5 C2.1 | C1.1 46.99,98.5 | C8.1 29.21,90.88 25.91,87.58 25.91,84.02 | v21.59,83.26 25.15,83.26 25.91,84.02 | 25.91,84.02 v27.18,85.29 | v49.28,50.62 49.28,52.53 52.07,55.32 68.07,55.32 C16.1 72.64,50.75 IC3.8 78.99,47.95 | C3.1 81.28,45.67 78.99,47.95 | 78.99,47.95 78.74,47.7 72.39,47.7 66.04,41.35 28.7,41.35 IC2.12 | v71.25,84.66 70.99,84.66 69.98,85.67 69.98,87.58 73.66,91.26 C7.1 | C25.+ 51.56,97.74 50.8,98.5
A-5V  (via drill 0.35)
  Top 0.254: U$3.8 52.7,48.33 52.44,48.07 C46.2
  Top 0.508: C10.2 IC2.13 | IC4.4 33.27,58.37 C19.2 | IC9.4 17.14,96.59 16.51,97.23 16.51,99.77 17.14,100.41 | IC9.1 17.14,100.41 | 17.14,100.41 14.86,100.41 C14.2 11.43,98.25 11.43,83.26 2.54,74.37 2.54,51.51 5.08,48.97 7.62,48.97 | IC7.4 61.59,96.59 60.96,97.23 60.96,99.77 61.59,100.41 IC7.1 59.05,100.41 C12.2 | C13.2 79.38,100.41 IC5.1 85.22,100.41 85.85,99.77 85.85,97.1 85.34,96.59 IC5.4 83.44,96.59 v82.17,95.32 | C11.2 34.92,100.41 IC8.1 40.51,100.41 41.15,99.77 41.15,97.1 40.64,96.59 IC8.4 38.48,95.78 v38.48,95.58 | U$1.6 80.64,85.16 v81.15,85.67 81.28,85.55 81.28,81.99 C27.2 | U$2.6 35.69,85.16 v36.32,85.8 36.32,81.48 C15.2 | C17.2 84.33,57.86 IC3.4 | X2.2 7.62,48.97 | 7.62,48.97 6.86,48.2 C21.- | v52.07,43.89 52.44,44.26 C46.2 | C4.2 IC1.13
  Bottom 0.508: C17.2 89.92,58.11 | 89.92,58.11 91.44,59.64 91.44,74.37 88.9,76.91 81.28,76.91 | 81.28,76.91 C27.2 | C21.- 22.86,42.62 | 22.86,42.62 24.13,43.89 C10.2 | C19.2 31.75,55.83 31.75,46.43 27.94,42.62 | 22.86,42.62 27.94,42.62 | v52.07,43.89 50.8,42.62 27.94,42.62 | C4.2 80.52,42.62 82.55,42.62 86.36,46.43 86.36,55.32 89.15,58.11 89.92,58.11 | C13.2 76.45,103.33 58.42,103.33 | 58.42,103.33 C12.2 | C14.2 16.51,101.04 19.05,98.5 29.21,98.5 31.75,101.04 C11.2 43.18,101.04 45.47,103.33 58.42,103.33 | v36.32,85.8 37.59,87.07 37.59,94.69 v38.48,95.58 | v81.15,85.67 82.04,86.56 82.04,95.2 v82.17,95.32 | C26.- 61.21,76.91 81.28,76.91
AD_ALARM  (via drill 0.35)
  Top 0.254: IC6.35 50.5,32 54.48,28.02 54.48,26.11 v54.36,26.11 | v29.21,24.84 28.57,24.84 26.04,22.3 IC10.11
  Bottom 0.254: v54.36,26.11 53.09,24.84 v29.21,24.84
AD_CS
  Top 0.254: IC11.14 51.44,22.93 49.17,25.2 IC6.38
AD_SCLK
  Top 0.254: IC11.13 52.7,24.2 50.8,26.11 50.8,30.02 49.81,31 IC6.37
AD_SDI
  Top 0.254: IC6.1 55.08,30.39 55.24,30.22 55.88,29.59 55.88,18.49 54.61,18.49 53.98,19.12 IC11.12
AD_SDO
  Top 0.254: IC11.11 55.24,22.93 52.07,26.11 52.07,29.41 49.98,31.5 IC6.36
ADCIN+L
  Top 0.254: IC6.16 56.34,38 58.42,40.08 58.42,48.84 58.35,48.91 | 58.35,48.91 C34.2 | U$3.9 58.28,48.83 58.35,48.91
ADCIN+R
  Top 0.254: IC6.23 49.1,38.07 48.45,38.07 44.04,42.48 44.04,45.33 44.77,46.05 44.77,47.45 45.85,48.52 45.85,48.97 | 45.85,48.97 C28.2 | U$3.2 45.98,48.83 45.85,48.97
ADCIN-L
  Top 0.254: IC6.18 56.07,39 58.01,40.94 58.01,45.44 C32.2 55.62,47.83 U$3.7
ADCIN-R
  Top 0.254: IC6.21 49.1,39.07 48.45,39.07 44.45,43.07 44.45,45.16 45.72,46.43 C30.2 47.26,47.83 U$3.4
D+5V
  Top 0.254: IC6.2 52.51,31 51.01,32.5 IC6.34 49.13,32.46 48.26,32.46 48.26,31.19 47.77,30.7 C40.1 | IC11.16 48.85,20.6 48.85,17.91 49.53,17.22 55.88,17.22 56.52,17.85 IC11.10
  Top 0.508: IC2.1 10.67,31.7 C44.1 10.16,26.87 X3.1 10.65,24.35 13.97,21.03 17.39,21.03 C47.1 19.6,20.63 IC10.16 19.68,17.85 20.32,17.22 26.67,17.22 27.3,17.85 IC10.10 | IC2.1 19.81,35 24.13,35 | 24.13,35 30.99,35 IC2.8 41.4,24.59 C24.+ | IC2.4 24.13,35 | C23.1 16.51,29.54 IC2.1 | C24.+ 43.07,20.63 C48.1 47.08,20.55 IC11.16 | C22.1 71.12,28.65 IC1.1 73.15,33.73 78.74,33.73 | IC1.8 86.87,33.73 78.74,33.73 | IC1.4 78.74,33.73 | C40.1 41.4,24.85 C24.+
  Bottom 0.508: 68.58,24.84 60.96,24.84 58.42,22.3 C24.+ | 68.58,24.84 69.85,24.84 C22.1 | C43.+ 68.58,24.84
DGND  (via drill 0.35)
  Top 0.254: v46.1,32.46 46.12,32.45 C40.2 47.67,32.45 48.16,32.93 49.1,32.93 IC6.33 | IC6.4 IC6.3 56.08,31.5 v56.13,31.44 | IC11.9 v57.78,18.74 | IC11.15 v50.16,18.74 | C48.2 v46.99,17.73 | IC10.9 v28.57,18.74 | IC10.15 v20.95,18.74 | C47.2 v17.78,17.73
  pour Bottom (rank 2): -1.27,38.81 101.6,38.81 101.6,13.41 -3.81,13.41 -3.81,38.81
DYNALO_LEFT+  (via drill 0.35)
  Top 0.508: R14.1 67.31,46.43 72.39,51.51 v72.39,66.75 67.36,66.75 X4.1
  Bottom 0.508: v72.39,66.75 74.3,68.66 85.72,68.66 88.16,71.09 X6.1
DYNALO_LEFT-
  Top 0.508: X6.5 62.2,71.8 57.15,66.75 57.17,66.73 X4.2 57.17,60.61 R16.1
DYNALO_RIGHT+
  Top 0.508: R10.1 39.37,50.24 39.37,56.59 38.1,57.86 38.1,70.01 X7.1
  Bottom 0.508: X7.1 47.01,64.69 X4.4
DYNALO_RIGHT-  (via drill 0.35)
  Top 0.508: v35.56,45.16 36.83,43.89 R12.1
  Bottom 0.508: X7.5 30.98,60.4 34.29,60.4 | 34.29,60.4 35.56,59.13 v35.56,45.16 | X4.5 40.69,60.4 34.29,60.4
GND  (via drill 0.35)
  Top 0.254: IC6.6 53.63,33 v53.59,32.97 | IC6.8 53.86,34 53.59,33.73 v53.34,33.73 | IC6.31 50.15,34 v50.42,33.73 50.19,33.5 IC6.32 | C42.1 48.12,35 IC6.29 50.93,35 v51.18,35.25 | C42.1 47.62,35.5 IC6.28 50.28,35.5 v50.42,35.63 | C42.1 46.24,35.75 v46.23,35.76 | IC6.26 50.52,36.5 v50.8,36.78 | IC6.24 50.51,37.5 v50.8,37.79 | IC6.22 50.49,38.5 v50.8,38.81 | IC6.20 50.47,39.5 v50.8,39.83 | v53.59,36.02 53.81,36.02 54.33,35.5 IC6.11 | IC6.13 54,36.5 v53.59,36.91 | IC6.15 54.02,37.5 v53.59,37.92 | IC6.17 54.03,38.5 v53.59,38.94 | IC6.19 53.92,39.5 v53.59,39.83 | v59.11,36.91 59.11,35.82 C41.2 C36.1 C39.2 v60.25,32.97 | C33.1 v66.29,43.89 | C35.1 v66.29,50.24 | C31.1 v36.45,46.43 | C29.1 v36.58,52.78 | C46.1 v49.53,45.79 | C45.2 v53.59,51 | v53.59,35.16 53.75,35 IC6.10
  Top 0.508: U$2.2 27.56,86.44 v27.43,86.56 | U$2.7 35.61,86.44 v36.05,86.87 | U$1.2 72.03,86.44 v71.78,86.18 | U$1.7 80.14,86.44 v80.52,86.82
  Bottom 0.254: v51.18,35.25 50.93,35 50.8,35
  pour Bottom (isolate 0.254): 52.07,32.59 52.07,33.48 41.78,33.48 41.78,35.13 0,35.13 0,136.6 100.08,136.6 100.08,35.51 69.09,35.51 66.17,32.59
  cutout Bottom: 71.12,122.63 71.12,104.85 33.02,104.85 33.02,122.63
ISO_AD_ALARM
  Top 0.508: IC10.6 26.04,10.23 27.94,8.33 30.48,8.33 31.75,7.06 45.72,7.06 X8.6
ISO_AD_CS
  Top 0.508: IC11.3 51.44,8.96 49.53,7.06 X8.5
ISO_AD_SCLK
  Top 0.508: IC11.4 52.7,6.42 X8.4
ISO_AD_SDI
  Top 0.508: IC11.5 53.98,6.42 X8.3
ISO_AD_SDO
  Top 0.508: IC11.6 55.24,8.96 57.15,7.06 X8.2
ISO_PGA_CS
  Top 0.508: IC10.3 22.23,8.96 21.59,8.33 X5.4
ISO_PGA_SCLK
  Top 0.508: IC10.5 24.77,8.96 26.67,7.06 X5.2
ISO_PGA_SDI
  Top 0.508: IC10.4 23.5,8.96 24.13,8.33 X5.3
LINEL+  (via drill 1 pad 1.8)
  Top 0.508: 66.8,97.36 67.31,97.86 IC7.6 | 66.8,97.36 66.8,93.93 R2.2 v69.85,93.42 | 66.8,97.36 66.8,102.44 66.99,102.63 | 66.99,102.63 67.56,103.2 75.31,103.2 76.58,104.47 76.58,111.58 RELAY_LINE_XLR_R.11 | 66.99,102.63 64.45,102.63 62.23,104.85 62.23,108.66 59.69,111.2 49.53,111.2 RELAY_LINE_RCA.6
LINEL-  (via drill 1 pad 1.8)
  Top 0.508: IC5.6 87.63,97.86 86.74,96.98 | 86.74,96.98 86.74,93.04 R3.2 v88.9,93.42 | 86.74,96.98 86.74,101.93 85.09,103.58 81.28,103.58 RELAY_LINE_XLR_R.6
LINER+  (via drill 1 pad 1.8)
  Top 0.508: 22.23,97.1 22.99,97.86 IC9.6 | 22.23,97.1 22.23,94.05 R7.2 v25.4,93.42 | RELAY_LINE_XLR_L.11 22.23,105.48 22.23,97.1
  Bottom 0.508: RELAY_LINE_RCA.11 43.76,106.12 41.62,103.99 24.99,103.99 RELAY_LINE_XLR_L.11
LINER-  (via drill 1 pad 1.8)
  Top 0.508: 42.29,96.85 43.31,97.86 IC8.6 | 42.29,96.85 42.29,93.04 R6.2 v44.45,93.42 | 42.29,96.85 42.29,101.93 33.02,111.2 25.4,111.2 RELAY_LINE_XLR_L.6
N$2
  Top 0.508: IC4.2 IC4.1 34.29,45.67 IC2.9
N$3
  Top 0.508: IC2.16 16.51,48.21 IC4.7 IC4.6
N$4
  Top 0.508: IC3.2 IC3.1 88.9,45.67 IC1.9
N$5
  Top 0.508: IC3.6 IC3.7 71.12,48.21 IC1.16
N$6
  Top 0.508: RELAY_LINE_XLR_R.8 85.09,106.12 86.36,107.39 86.36,117.59 LINE_XLR_L.3
N$8
  Top 0.508: RELAY_LINE_XLR_R.9 83.82,116.32 LINE_XLR_L.2
N$9
  Top 0.508: LINE_XLR_R.3 17.78,116.17 RELAY_LINE_XLR_L.8
N$10
  Top 0.508: RELAY_LINE_XLR_L.9 15.24,108.66 15.24,114.9 LINE_XLR_R.2
N$11
  Top 0.508: LINE_RCA_L.1_+ 60,124.86 58.42,126.44 48.26,126.44 41.91,120.09 RELAY_LINE_RCA.8
N$12
  Top 0.508: RELAY_LINE_RCA.9 41.91,107.39 39.37,109.93 39.37,123.42 LINE_RCA_R.1_+
N$13
  Top 0.508: IC5.3 81.92,97.86 81.28,97.23 81.28,90.88 80.01,89.61 77.98,89.61 76.96,88.59 76.96,84.4 77.47,83.89 U$1.5
N$14
  Top 0.508: U$1.4 75.56,83.89 75.95,84.28 75.95,88.34 75.31,88.97 68.96,88.97 65.41,92.53 65.41,97.23 64.77,97.86 IC7.3
N$16
  Top 0.508: R4.2 80.64,87.7 U$1.8 88.9,87.7 R3.1
N$17
  Top 0.508: U$1.1 72.14,87.7 69.85,85.42 | 69.85,85.42 R2.1 | 69.85,85.42 64.77,85.42 R5.2
N$20
  Top 0.508: U$2.4 30.99,83.89 31.24,84.15 31.24,88.72 30.86,89.1 24.38,89.1 20.83,92.66 20.83,97.23 20.19,97.86 IC9.3
N$21
  Top 0.508: U$2.5 33.15,83.89 32.26,84.78 32.26,88.21 34.04,89.99 36.45,89.99 37.34,90.88 37.34,97.23 37.97,97.86 IC8.3
N$23
  Top 0.508: U$2.8 37.47,87.7 | R8.2 39.37,89.61 37.47,87.7 | 37.47,87.7 44.45,87.7 R6.1
N$24
  Top 0.508: U$2.1 26.04,87.7 25.4,87.07 | 25.4,87.07 24.13,85.8 20.32,85.8 R9.2 | 25.4,87.07 R7.1
N$25
  Top 0.254: R11.1 C29.2 40.87,52.68 R10.2 C28.1
N$26
  Top 0.254: U$3.1 47.9,49.33 46.99,50.24 46.99,51.74 R11.2
N$27
  Top 0.254: C31.2 C30.1 42.95,46.33 R13.1 R12.2
N$29
  Top 0.254: R13.2 46.99,44.93 46.99,46.43 47.9,47.33 U$3.5
N$30  (via drill 0.35)
  Top 0.254: C36.2 56.84,33.79 56.15,33.79 | IC6.7 55.86,33.5 56.15,33.79 | 56.15,33.79 v56.15,33.9
  Bottom 0.254: C37.2 59.31,38.81 56.26,35.76 56.26,34.01 v56.15,33.9
N$31
  Top 0.254: R14.2 C32.1 59.82,43.99 R15.1 C33.2
N$32
  Top 0.254: R15.2 56.92,44.12 55.88,45.16 55.88,46.43 54.98,47.33 U$3.6
N$33  (via drill 0.35)
  Top 0.254: IC6.5 56.49,32.5 57.19,33.2 C39.1 56.3,32.97 v56.28,32.99
  Bottom 0.254: v56.28,32.99 58.31,32.99 60.33,35 C38.1
N$34
  Top 0.254: C35.2 C34.1 59.92,50.34 R17.1 R16.2
N$35
  Top 0.254: U$3.10 54.98,49.33 55.88,50.24 55.88,51.74 R17.2
PGA_CS
  Top 0.254: IC10.14 22.23,22.93 19.05,26.11 IC2.2
  Bottom 0.254: IC2.2 23.37,27.38 69.34,27.38 IC1.2
PGA_LEFT+
  Top 0.508: IC1.11 83.82,45.16 80.01,48.97 80.01,68.74 X6.2 83.08,72.4 83.06,72.42 83.06,79.96 R4.1
PGA_LEFT-
  Top 0.508: IC1.14 76.2,46.43 78.74,48.97 78.74,62.94 73.05,68.63 73.05,71.68 X6.4 64.77,79.95 R5.1
PGA_RIGHT+
  Top 0.508: IC2.11 29.21,46.43 26.67,48.97 26.67,65.48 27.94,66.75 29.76,66.75 X7.2 39.37,76.36 R8.1
PGA_RIGHT-
  Top 0.508: IC2.14 21.59,45.16 24.13,47.7 24.13,71.28 X7.4 24.13,72.33 24.13,75.64 20.32,79.45 R9.1
PGA_SCLK
  Top 0.254: IC10.12 24.77,26.74 29.21,31.19 IC2.6
  Bottom 0.254: IC2.6 30.17,31.7 31.29,32.82 40.28,32.82 43.05,30.05 65.41,30.05 69.47,34.11 82.17,34.11 83.82,32.46 IC1.6
PGA_SDI
  Top 0.254: IC10.13 23.5,25.47 21.59,27.38 IC2.3
PGA_SDO
  Bottom 0.254: IC1.3 74.83,33.07 70.08,33.07 65.66,28.65 39.37,28.65 | IC2.7 31.75,29.92 33.02,28.65 39.37,28.65 | R1.1 39.37,28.65
PI_5V
  Top 0.508: C50.1 17.78,11.63 19.4,11.63 IC10.1 | IC10.1 19.68,8.96 19.05,8.33 X5.5 | C49.1 48.5,11.74 IC11.1 48.9,13.28 50.29,14.68 | IC11.7 56.52,12.77 54.61,14.68 | 54.61,14.68 50.29,14.68 | IC10.1 19.68,14.04 20.32,14.68 25.4,14.68 | 25.4,14.68 27.3,12.77 IC10.7 | C51.+ 59.69,14.68 54.61,14.68 | 25.4,14.68 33.02,14.68 | 33.02,14.68 50.29,14.68 | C52.+ 33.02,12.14 33.02,14.68
PI_GND  (via drill 0.35)
  Top 0.254: IC11.8 v57.78,9.47
  Top 0.508: C49.2 v46.99,8.84 | C50.2 v17.78,14.93 | IC10.2 v20.95,13.03 | IC10.8 v28.57,13.16 | IC11.2 50.16,12.77 v50.8,13.41
  pour Bottom (isolate 0.254): 0,15.57 101.6,15.57 101.6,-1.83 0,-1.83
R-2R_LEFT+
  Bottom 0.508: JP3.14 JP3.13 12.7,92.52 12.7,83.26 20.32,75.64 41.02,75.64 51.05,65.61 67.25,65.61 75.7,57.16 79.44,57.16 80.77,55.83 IC3.3
R-2R_LEFT-
  Top 0.508: JP3.16 JP3.15
  Bottom 0.508: JP3.15 13.97,93.79 13.97,84.53 21.59,76.91 42.67,76.91 51.82,67.77 65.79,67.77 66.04,68.02 68.58,68.02 76.2,60.4 IC3.5
R-2R_RIGHT+
  Bottom 0.508: JP3.8 JP3.7 10.16,87.44 10.16,81.99 13.97,78.18 13.97,71.83 25.4,60.4 25.4,56.59 26.16,55.83 IC4.3
R-2R_RIGHT-
  Bottom 0.508: 6.54,88.52 8.51,86.55 8.51,80.72 11.43,77.8 11.43,68.53 IC4.5 | 6.54,88.52 JP3.5 | JP3.6 4,88.52 6.54,88.52
RCA_CTRL
  Bottom 0.508: J1.4 49.53,118.19 49.53,109.93 50.8,108.66 58.42,108.66 59.69,107.39 RELAY_LINE_RCA.16
RELAY_5V
  Bottom 0.508: RELAY_LINE_XLR_R.1 68.58,108.66 68.58,116.28 66.04,118.82 57.91,118.82 | 57.91,118.82 J1.1 J1.2 52.7,121.36 43.18,121.36 RELAY_LINE_XLR_L.1 | RELAY_LINE_RCA.1 57.91,115.52 57.91,118.82
XLR_L_CTRL
  Bottom 0.508: RELAY_LINE_XLR_L.16 39.37,109.93 41.91,109.93 44.45,112.47 44.45,116.28 46.99,118.82 J1.5
XLR_R_CTRL
  Bottom 0.508: J1.3 52.7,116.91 58.42,111.2 64.77,111.2 66.04,112.47 RELAY_LINE_XLR_R.16

### Text on the board
tPlace: LINE_RCA_R | LINE_RCA_L | LINE OUT RELAY CTRL | XLRL RCA XLRR 5V 5V | LINE L+ | LINE L- | LINE R+ | LINE R- | BUF634A | BUF634A | BUF634A | BUF634A | L+OUT | L-OUT | R+OUT | R-OUT | L- / L+ / G / G / R+ / R- | OPA1632 | OPA1632 | R- R+ G L- L+ | R-O R-I G R+I R+O | L-O L-I G L+I L+O | 1uF | 100k | A+5V G G A-5V | PGA2311 | PGA2311 | DGND D+5V | SI8641 | SI8641 | Vwvwbg Dam1941 / Analog Board | Volume Control & DC detector include | 5V CS SDI SCLK GND | ALARM CS SCLK SDI SDO GND
bPlace: AGND | bead | DGND | PI_GND